# EAGLE schematic impedance (EAGLE 6.5.0)
DESIGNER: Jon Newman, MWL@MIT; REVISION: 1.0
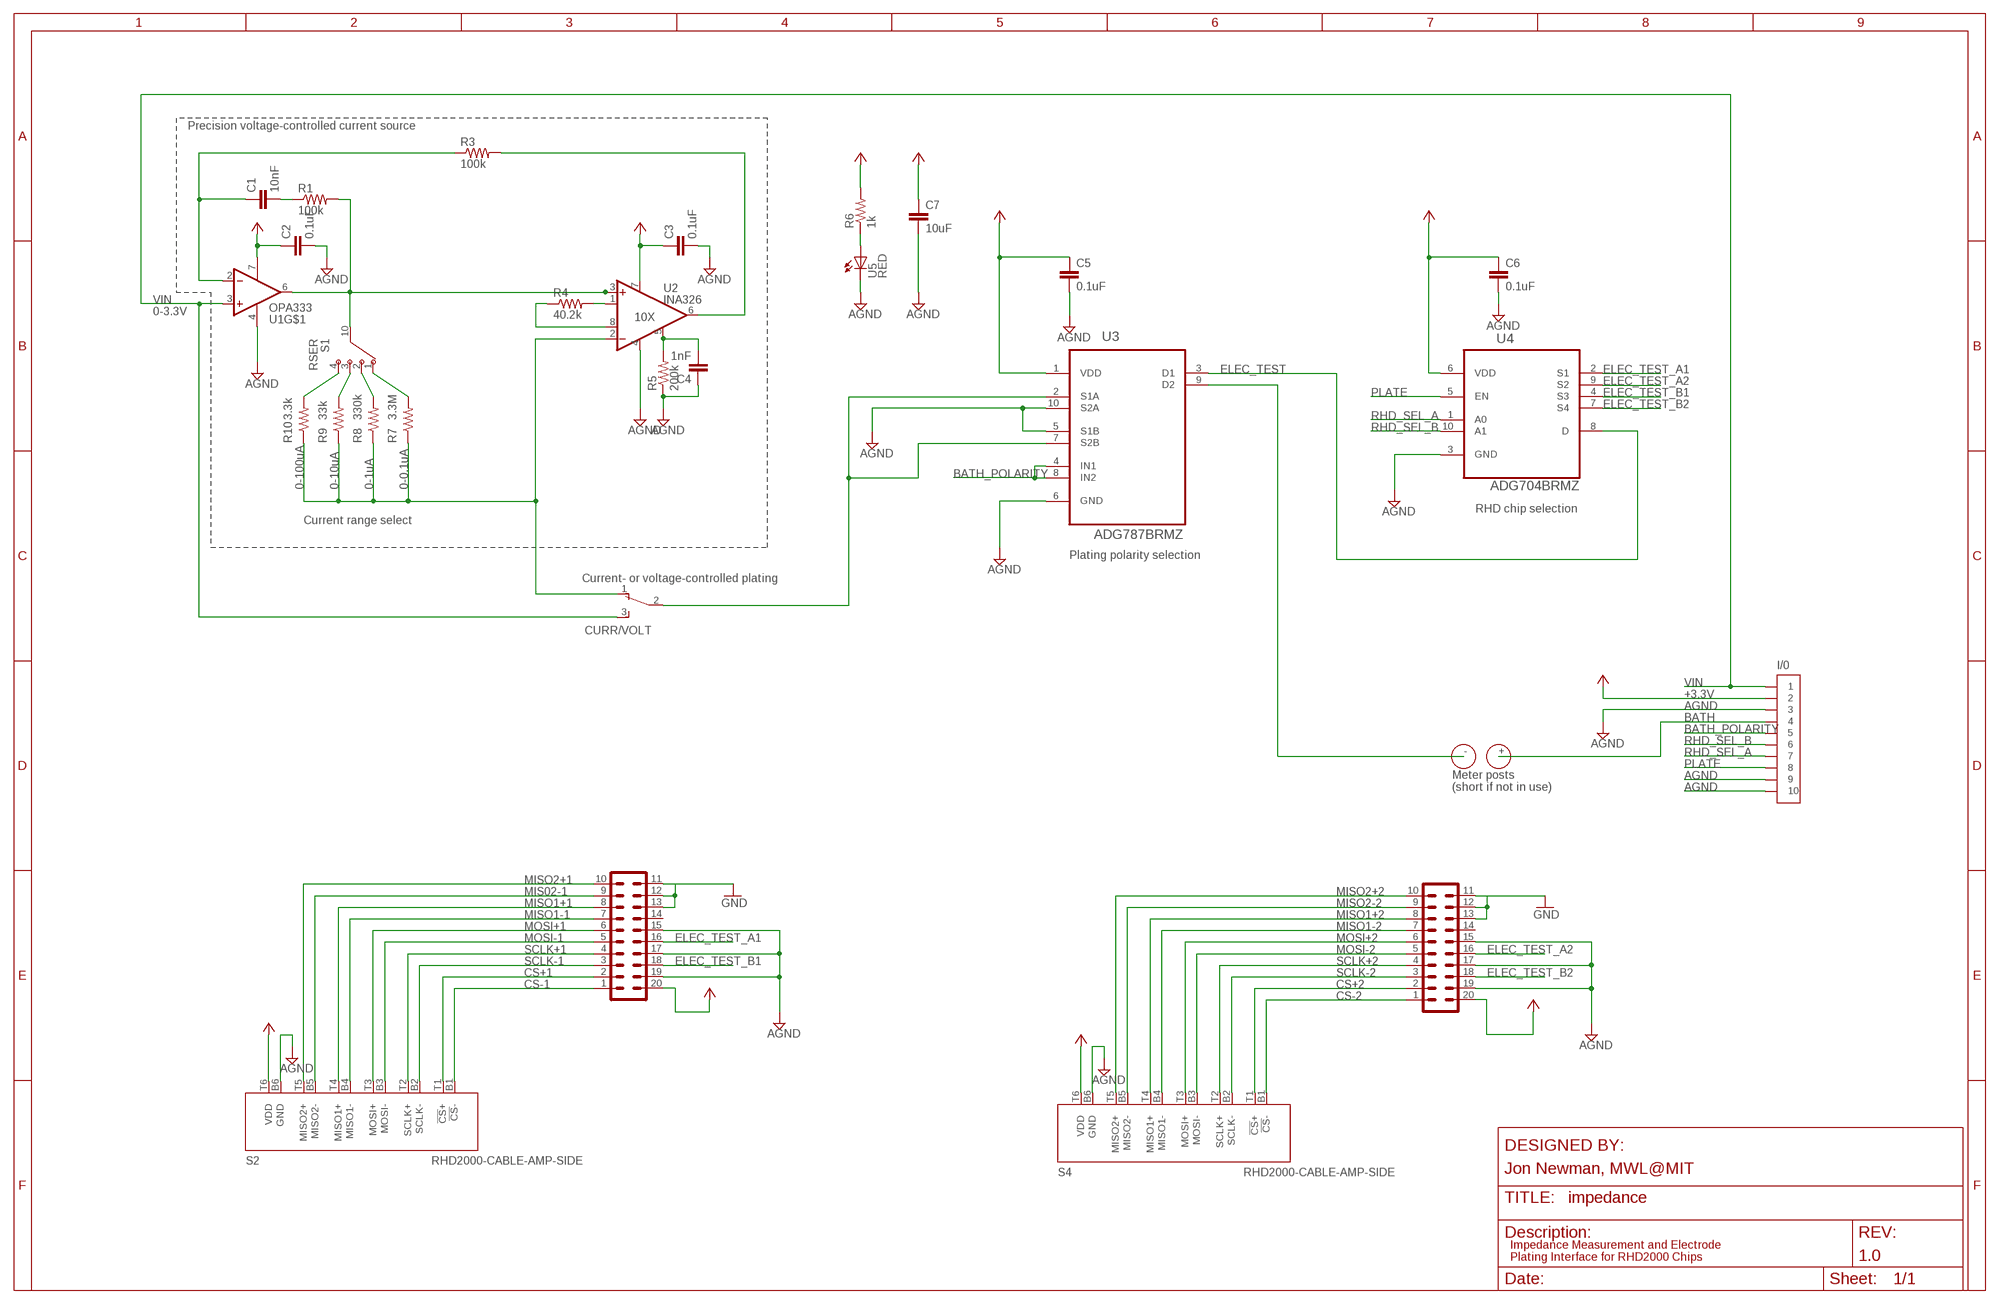
[diagram p0: schematic, sheet 1]

## Parts
C1  10nF  C_0805  [0805]
C2  0.1uF  C_0805  [0805]
C3  0.1uF  C_0805  [0805]
C4  1nF  C_0805  [0805]
C5  0.1uF  C_0805  [0805]
C6  0.1uF  C_0805  [0805]
C7  10uF  C_1206  [1206]
CURR/VOLT  SPDT_PCM12  [PCM12]
HS1  JMD20-V  PINHD-2X10_JMD20-V  [JMD20-V]
HS2  JMD20-V  PINHD-2X10_JMD20-V  [JMD20-V]
I/0  SCREW10_0.1-THRU  [SCREW10]
R1  100k  R_0805  [0805]
R3  100k  R_0805  [0805]
R4  40.2k  R_0805  [0805]
R5  200k  R_0805  [0805]
R6  1k  R_0805  [0805]
R7  3.3M  R_0805  [0805]
R8  330k  R_0805  [0805]
R9  33k  R_0805  [0805]
R10  3.3k  R_0805  [0805]
S1  RSER  SP4T_C-K-R-SERIES  [R-SWITCH]
S2  RHD2000-CABLE-AMP-SIDE  [OMNETICS_PZN-12-AA]
S4  RHD2000-CABLE-AMP-SIDE  [OMNETICS_PZN-12-AA]
U1  OPA333  OPAMP_SOIC  [SOIC127P600X175-8N]
U2  INA326  INSTAMP_PSOP8  [SOP65P490X110-8N]
U3  ADG787BRMZ  [SOP50P490X110-10N]
U4  ADG704BRMZ  [SOP50P490X110-10N]
U5  RED  LED_0603  [CHIP-LED0603]
U$2  DUAL-POST_BANANA  [BANANA-BINDING-POST]

## Nets
+3.3V: C2.1 C3.1 C5.1 C6.1 C7.1 HS1.20 HS2.20 I/0.P$2 R6.2 S2.T6(VDD) S4.T6(VDD) U1.7(V+) U3.1(VDD) U4.6(VDD)
AGND: C2.2 C3.2 C4.1 C5.2 C6.2 C7.2 HS1.15 HS1.17 HS1.19 HS2.15 HS2.17 HS2.19 I/0.P$3 I/0.P$9 I/0.P$10 R5.1 S2.B6(GND) S4.B6(GND) U1.4(V-) U2.4(V-) U3.5(S1B) U3.6(GND) U3.10(S2A) U4.3(GND) U5.C
BATH: I/0.P$4 U$2.+
BATH_POLARITY: I/0.P$5 U3.4(IN1) U3.8(IN2)
CS+1: HS1.2 S2.T1(!CS!+)
CS+2: HS2.2 S4.T1(!CS!+)
CS-1: HS1.1 S2.B1(!CS!-)
CS-2: HS2.1 S4.B1(!CS!-)
ELEC_TEST: U3.3(D1) U4.8(D)
ELEC_TEST_A1: HS1.16 U4.2(S1)
ELEC_TEST_A2: HS2.16 U4.9(S2)
ELEC_TEST_B1: HS1.18 U4.4(S3)
ELEC_TEST_B2: HS2.18 U4.7(S4)
GND: HS1.11 HS1.12 HS1.13 HS2.11 HS2.12 HS2.13
IOUT: CURR/VOLT.2 U3.2(S1A) U3.7(S2B)
MIS02-1: HS1.9 S2.B5(MISO2-)
MISO1+1: HS1.8 S2.T4(MISO1+)
MISO1+2: HS2.8 S4.T4(MISO1+)
MISO1-1: HS1.7 S2.B4(MISO1-)
MISO1-2: HS2.7 S4.B4(MISO1-)
MISO2+1: HS1.10 S2.T5(MISO2+)
MISO2+2: HS2.10 S4.T5(MISO2+)
MISO2-2: HS2.9 S4.B5(MISO2-)
MOSI+1: HS1.6 S2.T3(MOSI+)
MOSI+2: HS2.6 S4.T3(MOSI+)
MOSI-1: HS1.5 S2.B3(MOSI-)
MOSI-2: HS2.5 S4.B3(MOSI-)
N$1: R1.2 S1.10(COM) U1.6(OUT) U2.3(+IN)
N$2: R4.2 U2.1(R1_A)
N$3: R4.1 U2.8(R1_B)
N$4: C1.2 R1.1
N$5: C1.1 R3.1 U1.2(-IN)
N$6: R3.2 U2.6(OUT)
N$7: C4.2 R5.2 U2.5(R2)
N$9: R6.1 U5.A
N$10: CURR/VOLT.1 R7.1 R8.1 R9.1 R10.1 U2.2(-IN)
N$11: R10.2 S1.4
N$12: R9.2 S1.3
N$13: R8.2 S1.2
N$14: R7.2 S1.1
N$15: U3.9(D2) U$2.-
PLATE: I/0.P$6 U4.5(EN)
RHD_SEL_A: I/0.P$7 U4.1(A0)
RHD_SEL_B: I/0.P$8 U4.10(A1)
SCLK+1: HS1.4 S2.T2(SCLK+)
SCLK+2: HS2.4 S4.T2(SCLK+)
SCLK-1: HS1.3 S2.B2(SCLK-)
SCLK-2: HS2.3 S4.B2(SCLK-)
VIN: CURR/VOLT.3 I/0.P$1 U1.3(+IN)
Unconnected: HS1.14 HS2.14 U2.7(V+)

## Notes on the sheet
- Precision voltage-controlled current source
- 0-3.3V
- 10X
- 0-100uA | 0-10uA | 0-1uA | 0-0.1uA
- RHD chip selection
- Current range select
- Plating polarity selection
- Current- or voltage-controlled plating
- Meter posts
  (short if not in use)
- Impedance Measurement and Electrode
  Plating Interface for RHD2000 Chips

## Library data of the parts
C1-C6 = impedance:C: Capacitor; MN: TDK Corp.; PARTNO: C2012X5R1Cxxxxxxx; VID: DK
C7 = impedance:C: Capacitor
CURR/VOLT = impedance:SPDT: SPDT Switch
HS1 HS2 = headstage:PINHD-2X10
I/0 = impedance:SCREW10: Screw Terminal
R1 R3-R10 = impedance:R: Resistor
S1 = impedance:SP4T
S2 S4 = RHD2000:RHD2000-CABLE-AMP-SIDE
U1 = impedance:OPAMP
U2 = impedance:INSTAMP
U3 = impedance:ADG787BRMZ: 2:1 Mux/Demux USB 1.1 Switch; MPN: ADG787BRMZ; OC_FARNELL: 1117867; OC_NEWARK: 19M0695; PACKAGE: MSOP-10; SUPPLIER: Analog Devices
U4 = impedance:ADG704BRMZ: CMOS Low Voltage 4 V, 4-Channel Multiplexer; MPN: ADG704BRMZ; OC_FARNELL: 9425756; OC_NEWARK: 59K1493; PACKAGE: SOP-10; SUPPLIER: Analog Devices
U5 = impedance:LED
U$2 = impedance:DUAL-POST

## Net classes
1 thick: width 0.102 mm